# Altium project TINY_PENDANT_V1I1.PrjPcb
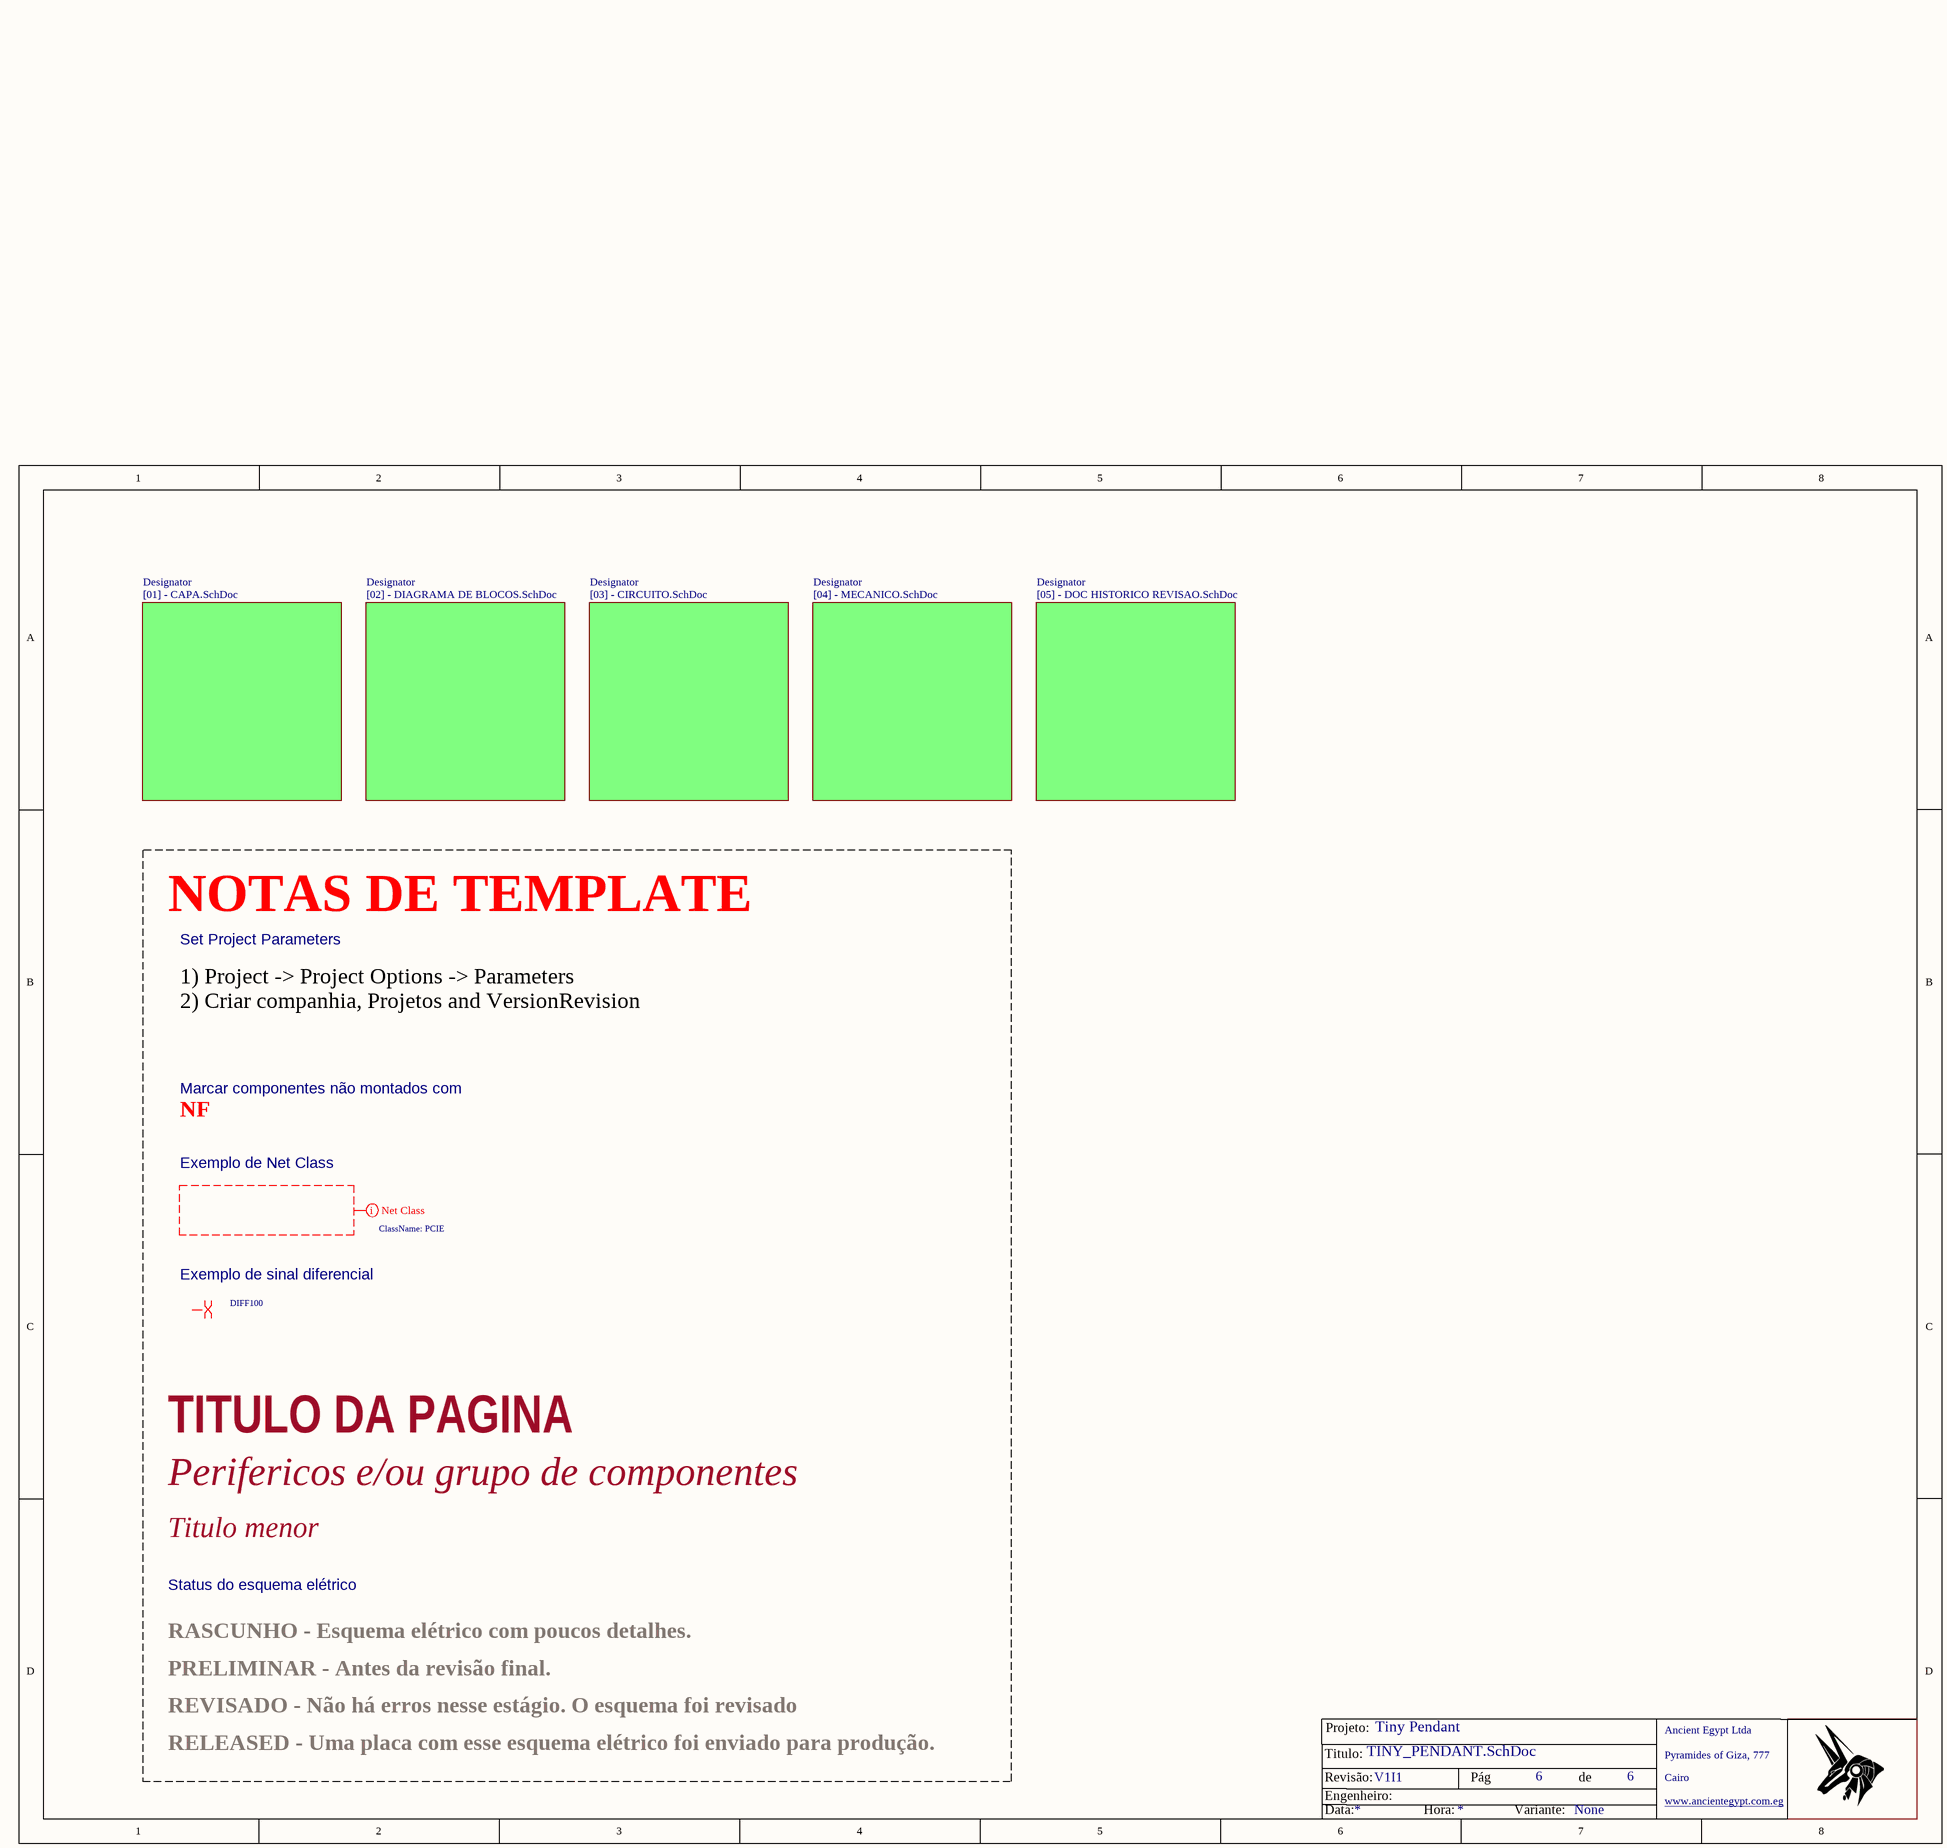
[diagram p0: TINY_PENDANT.SchDoc]
Moeda: USD; Projeto: Tiny Pendant; Variante: None; VersionRevision: V1I1
6 sheets, 6 parts. Net scope: global (net labels, ports and power ports of the same name join across sheets).
Board file: TINY_PENDANT_V1I1.PcbDoc
Sheets:
  TINY_PENDANT.SchDoc
    Designator = [01] - CAPA.SchDoc
    Designator = [02] - DIAGRAMA DE BLOCOS.SchDoc
    Designator = [03] - CIRCUITO.SchDoc
    Designator = [04] - MECANICO.SchDoc
    Designator = [05] - DOC HISTORICO REVISAO.SchDoc

## Sheet TINY_PENDANT.SchDoc
size A3; CompanyName: KDS; Organization: KDS; DocumentNumber: 6; Revision: V1I1; SheetNumber: 6; SheetTotal: 6; PageSetup: Record=PageOptions|CenterHorizontal=True|CenterVertical=True|PrintScale=1.07|XCorrection=1.00|YCorrection=1.00|PrintKind=1|BorderSize=5000000|LeftOffset=0|BottomOffset=0|Orientation=2|PaperLength=1000|PaperWidth=1000|Scale=100|PaperSource=7|PrintQuality=600|MediaType=1|DitherType=10|PaperKind=A3|PrintScaleMode=1; ProjectName: KDS C6A816x Module

### Sub-sheets
Designator = [01] - CAPA.SchDoc: no entries
Designator = [02] - DIAGRAMA DE BLOCOS.SchDoc: no entries
Designator = [03] - CIRCUITO.SchDoc: no entries
Designator = [04] - MECANICO.SchDoc: no entries
Designator = [05] - DOC HISTORICO REVISAO.SchDoc: no entries

### Layout directives
net class PCIE: (no net found under the mark)
differential pair; net class DIFF100: (no net found under the mark)

### Notes on the sheet
- NOTAS DE TEMPLATE
- Set Project Parameters
- 1) Project -> Project Options -> Parameters
  2) Criar companhia, Projetos and VersionRevision
- NF
- Marcar componentes não montados com
- Exemplo de Net Class
- Exemplo de sinal diferencial
- TITULO DA PAGINA
- Perifericos e/ou grupo de componentes
- Titulo menor
- Status do esquema elétrico
- PRELIMINAR - Antes da revisão final.
- RASCUNHO - Esquema elétrico com poucos detalhes.
- REVISADO - Não há erros nesse estágio. O esquema foi revisado
- RELEASED - Uma placa com esse esquema elétrico foi enviado para produção.
- Projeto:
- Ancient Egypt Ltda
- Revisão:
- Engenheiro:
- Titulo:
- Pág
- de
- Pyramides of Giza, 777
- Cairo
- www.ancientegypt.com.eg
- Data:
- Hora:
- Variante:

## Sheet [01] - CAPA.SchDoc
size A3; DocumentNumber: 1; SheetNumber: 1; SheetTotal: 6
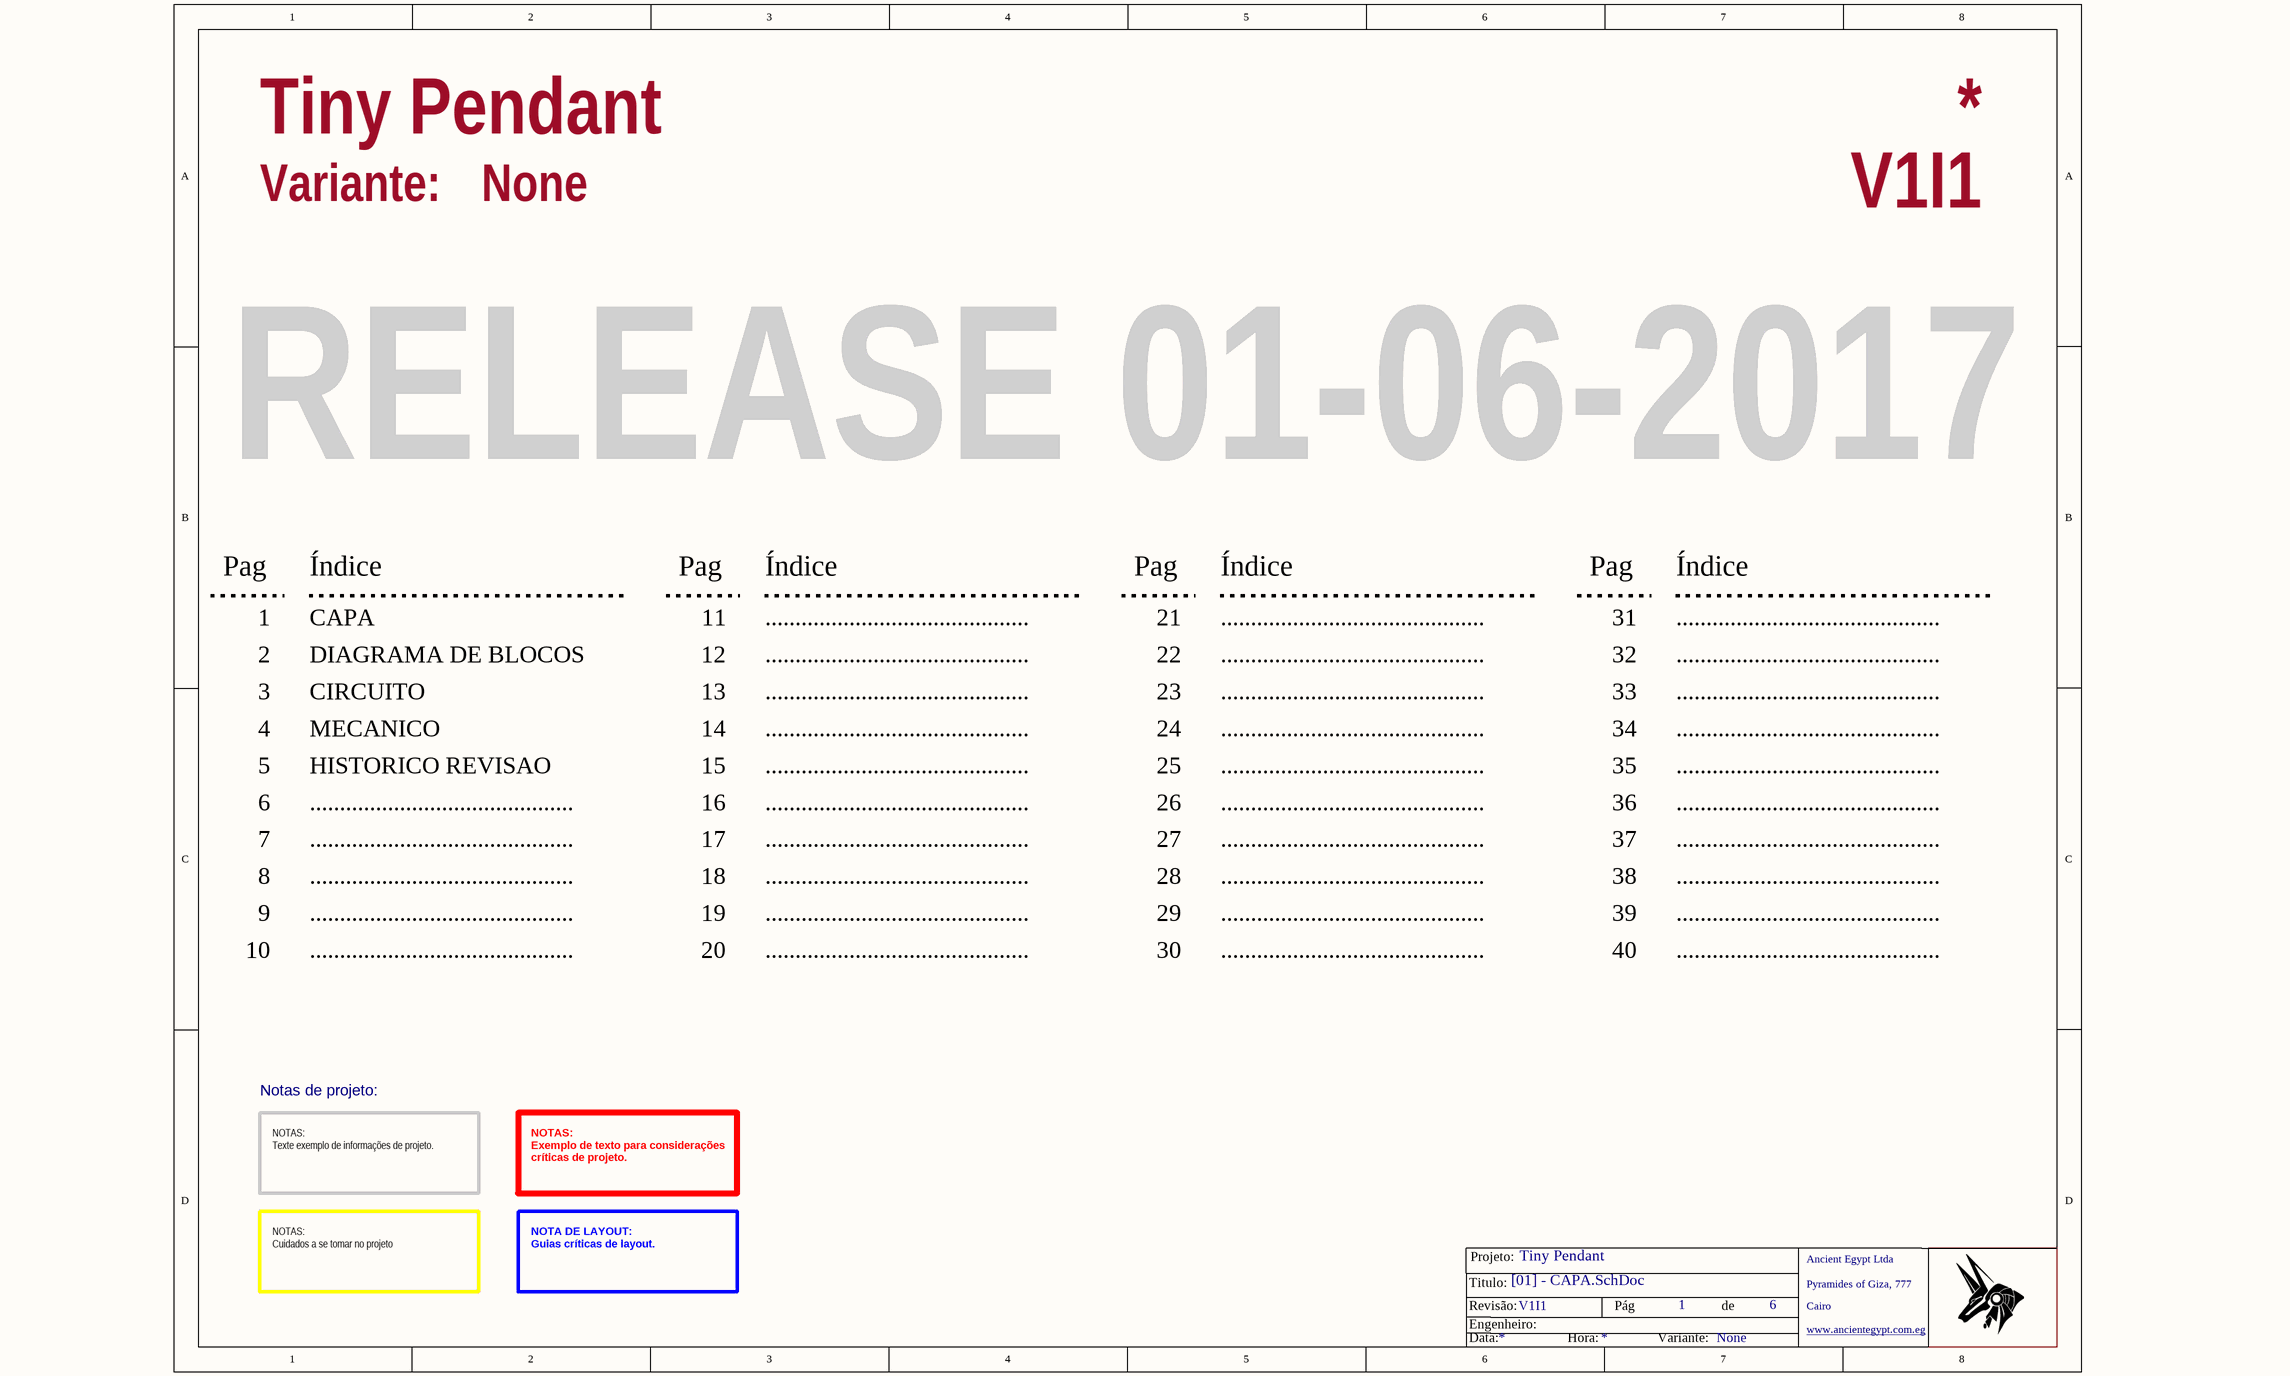
[diagram p1: [01] - CAPA.SchDoc]

### Notes on the sheet
- Variante:
- RELEASE 01-06-2017
- Pag
- Índice
- 1
- CAPA
- 11
- ............................................
- 21
- 31
- 2
- 3
- DIAGRAMA DE BLOCOS
- CIRCUITO
- 12
- 13
- 22
- 23
- 32
- 33
- 4
- 5
- MECANICO
- HISTORICO REVISAO
- 14
- 15
- 24
- 25
- 34
- 35
- 6
- 16
- 26
- 36
- 7
- 8
- 17
- 18
- 27
- 28
- 37
- 38
- 9
- 10
- 19
- 20
- 29
- 30
- 39
- 40
- Notas de projeto:
- NOTAS:
  Texte exemplo de informações de projeto.
- NOTAS:
  Exemplo de texto para considerações críticas de projeto.
- NOTAS:
  Cuidados a se tomar no projeto
- NOTA DE LAYOUT:
  Guias críticas de layout.
- Projeto:
- Ancient Egypt Ltda
- Revisão:
- Engenheiro:
- Titulo:
- Pág
- de
- Pyramides of Giza, 777
- Cairo
- www.ancientegypt.com.eg
- Data:
- Hora:

## Sheet [02] - DIAGRAMA DE BLOCOS.SchDoc
size A3; DocumentNumber: 2; SheetNumber: 2; SheetTotal: 6
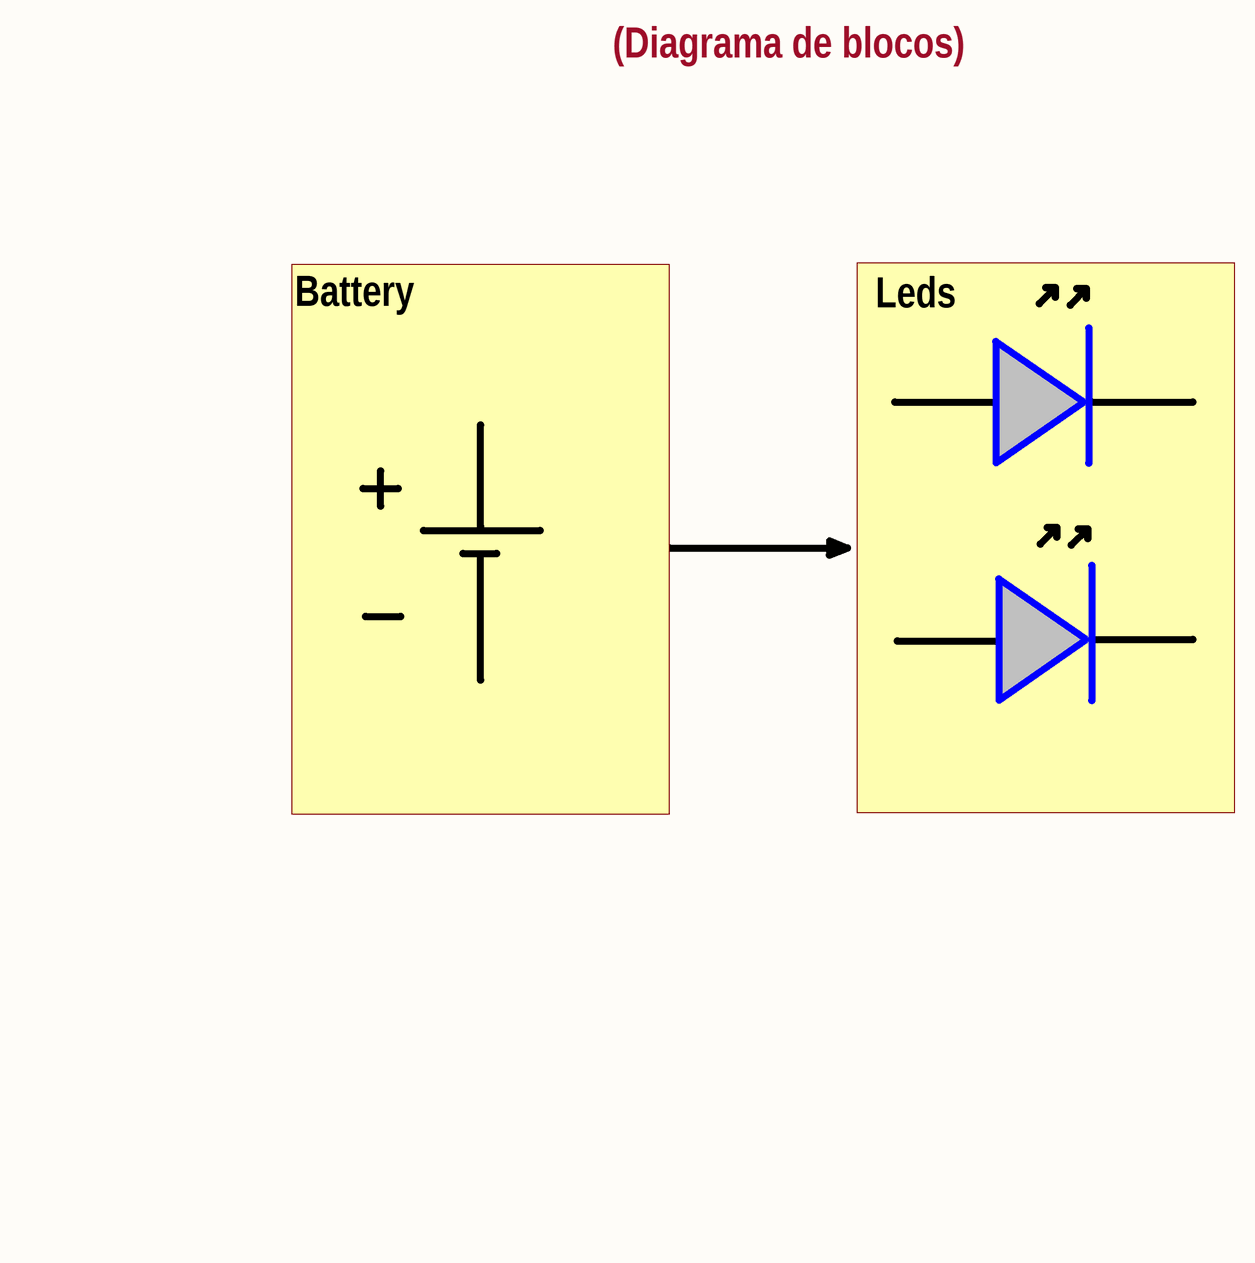
[diagram p2: [02] - DIAGRAMA DE BLOCOS.SchDoc]

### Notes on the sheet
- (Diagrama de blocos)
- Battery
- Leds
- CLOCKS (CPU & PCIE)
- Projeto:
- Ancient Egypt Ltda
- Revisão:
- Engenheiro:
- Titulo:
- Pág
- de
- Pyramides of Giza, 777
- Cairo
- www.ancientegypt.com.eg
- Data:
- Hora:
- Variante:

## Sheet [03] - CIRCUITO.SchDoc
size A4; DocumentNumber: 3; SheetNumber: 3; SheetTotal: 6
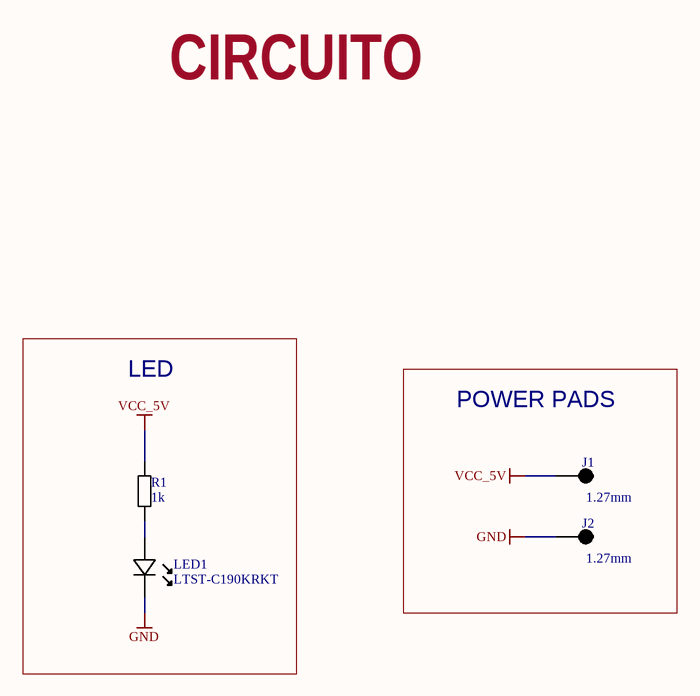
[diagram p3: [03] - CIRCUITO.SchDoc]

### Parts
J1  1.27mm  [SOLDER PAD - 1.27mm]  (no BOM)
J2  1.27mm  [SOLDER PAD - 1.27mm]  (no BOM)
LED1  Manufacturer Part Number: LTST-C190KRKT  [LED-0603-RED]  (hidden comment: RED)
R1  1k  [RESC1608X06N]

### Blocks framed on the sheet
LED: LED1 R1
POWER PADS: J1 J2

### Nets
GND: J2.1 LED1.K
VCC_5V: J1.1 R1.2
NetLED1_A: LED1.A R1.1

### Notes on the sheet
- CIRCUITO
- Projeto:
- Ancient Egypt Ltda
- Revisão:
- Engenheiro:
- Titulo:
- Pág
- de
- Pyramides of Giza, 777
- Cairo
- www.ancientegypt.com.eg
- Data:
- Hora:
- Variante:

### Library data of the parts
J1 J2 = SOLDER_PAD_R_127MM: SOLDER_PAD_ROUND_127MM; pad size: 1.27mm
LED1 = LED RED CLEAR 0603 SMD: Manufacturer: Lite-On Inc.; Lens Color: Colorless; Millicandela Rating: 99mcd; Lens Style/Size: Rectangle with Flat Top, 1.10mm x 0.80mm; Voltage - Forward (Vf) (Typ): 2V; Current - Test: 20mA; Viewing Angle: 130°; Wavelength - Dominant: 631nm; Wavelength - Peak: 639nm; Supplier 1: Digi-Key; RoHS: RoHS Compliant; Category: Optoelectronics; Stock 1: 1118453; Pricing 1: 1=0.27, 10=0.196, 25=0.1448, 100=0.1034, 250=0.07032, 500=0.06204, 1000=0.0486 (USD); Packaging: Cut Tape (CT); Color: Red; Lens Transparency: Clear; Mounting Type: Surface Mount; Features: -; Package / Case: 0603 (1608 Metric); Supplier Device Package: *; Size / Dimension: 1.60mm L x 0.80mm W; Height (Max): 0.80mm; ComponentLink1URL: http://optoelectronics.liteon.com/upload/download/DS-22-99-0151/S_110_LTST-C190KRKT.pdf; ComponentLink1Description: http://optoelectronics.liteon.com/upload/download/DS-22-99-0151/S_110_LTST-C190KRKT.pdf; Supplier Part Number 1: 160-1436-1-ND; Value: RED
R1 = RES 1K 0603 1%: RES SMD 1K OHM 1% 1/10W 0603; Manufacturer: Yageo; Manufacturer Part Number: RC0603JR-071KL; Tolerance: ±5%; Power (Watts): 0.1W, 1/10W; Temperature Coefficient: ±100ppm/°C; Supplier 1: Digi-Key; RoHS: RoHS Compliant; Category: Resistors; Stock 1: 4405000; Pricing 1: 5000=0.00149, 10000=0.00129, 25000=0.00113, 50000=0.00104, 125000=0.00102 (USD); Packaging: Tape & Reel (TR); Part Status: Active; Resistance (Ohms): 1k; Composition: Thick Film; Features: Moisture Resistant; Operating Temperature: -55°C ~ 155°C; Package / Case: 0603 (1608 Metric); Supplier Device Package: 0603; Size / Dimension: 0.063" L x 0.031" W (1.60mm x 0.80mm); Height - Seated (Max): 0.022" (0.55mm); Failure Rate: -; ComponentLink1URL: http://www.yageo.com/documents/recent/PYu-RC_Group_51_RoHS_L_7.pdf; ComponentLink1Description: http://www.yageo.com/documents/recent/PYu-RC_Group_51_RoHS_L_7.pdf; Supplier Part Number 1: 311-1.0KGRTR-ND; value: 1k

## Sheet [04] - MECANICO.SchDoc
size A4; DocumentNumber: 4; SheetNumber: 4; SheetTotal: 6
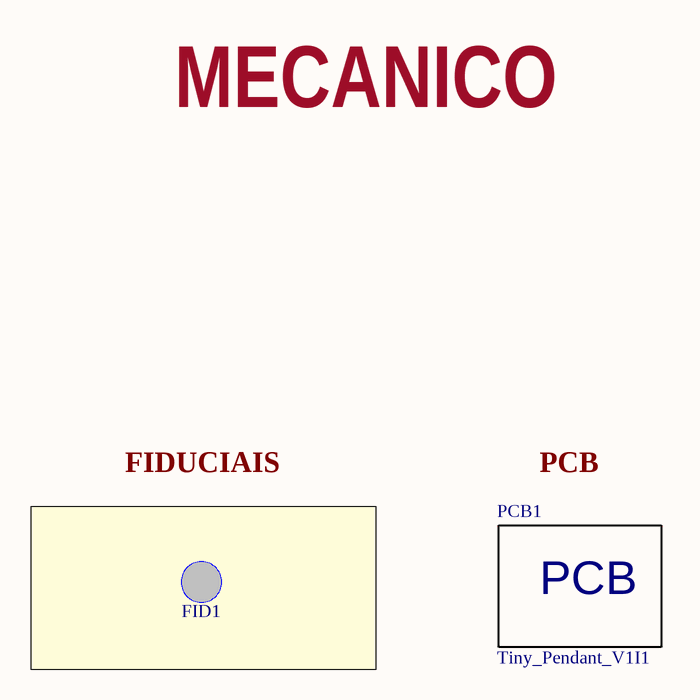
[diagram p4: [04] - MECANICO.SchDoc]

### Parts
FID1  FIDUCIAL  [FIDUCIAL - 1.27mm]  (value not drawn)  (no BOM)
PCB1  Tiny_Pendant_V1I1

### Blocks framed on the sheet
FIDUCIAIS: FID1

### Notes on the sheet
- MECANICO
- PCB
- Projeto:
- Ancient Egypt Ltda
- Revisão:
- Engenheiro:
- Titulo:
- Pág
- de
- Pyramides of Giza, 777
- Cairo
- www.ancientegypt.com.eg
- Data:
- Hora:
- Variante:

### Library data of the parts
FID1 = FIDUCIAL: Pad size: 1.27mm; Value: FIDUCIAL
PCB1 = PCB: Printed Circuit Board; Category: Printed Circuit Board

## Sheet [05] - DOC HISTORICO REVISAO.SchDoc
size A3; DocumentNumber: 5; SheetNumber: 5; SheetTotal: 6
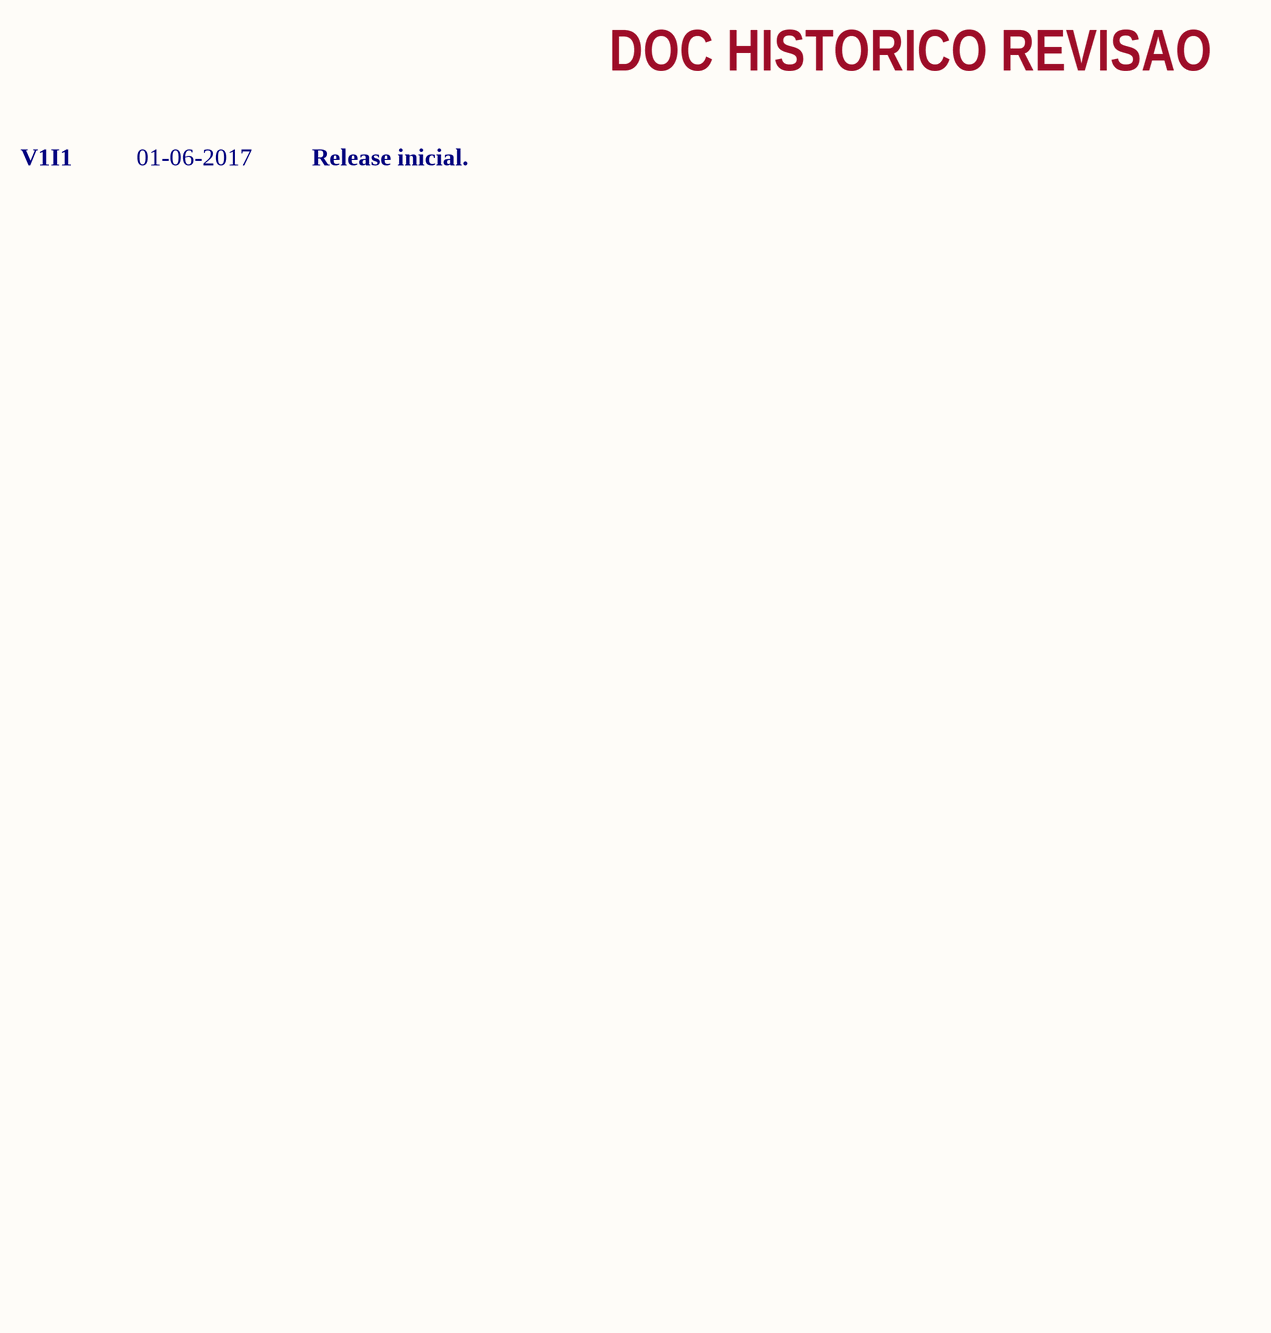
[diagram p5: [05] - DOC HISTORICO REVISAO.SchDoc]

### Notes on the sheet
- DOC HISTORICO REVISAO
- V1I1
- 01-06-2017
- Release inicial.
- CLOCKS (CPU & PCIE)
- Projeto:
- Ancient Egypt Ltda
- Revisão:
- Engenheiro:
- Titulo:
- Pág
- de
- Pyramides of Giza, 777
- Cairo
- www.ancientegypt.com.eg
- Data:
- Hora:
- Variante: